# EAGLE design TCC modulo de automação Wifi Rev.2   (EAGLE 8.4.0)
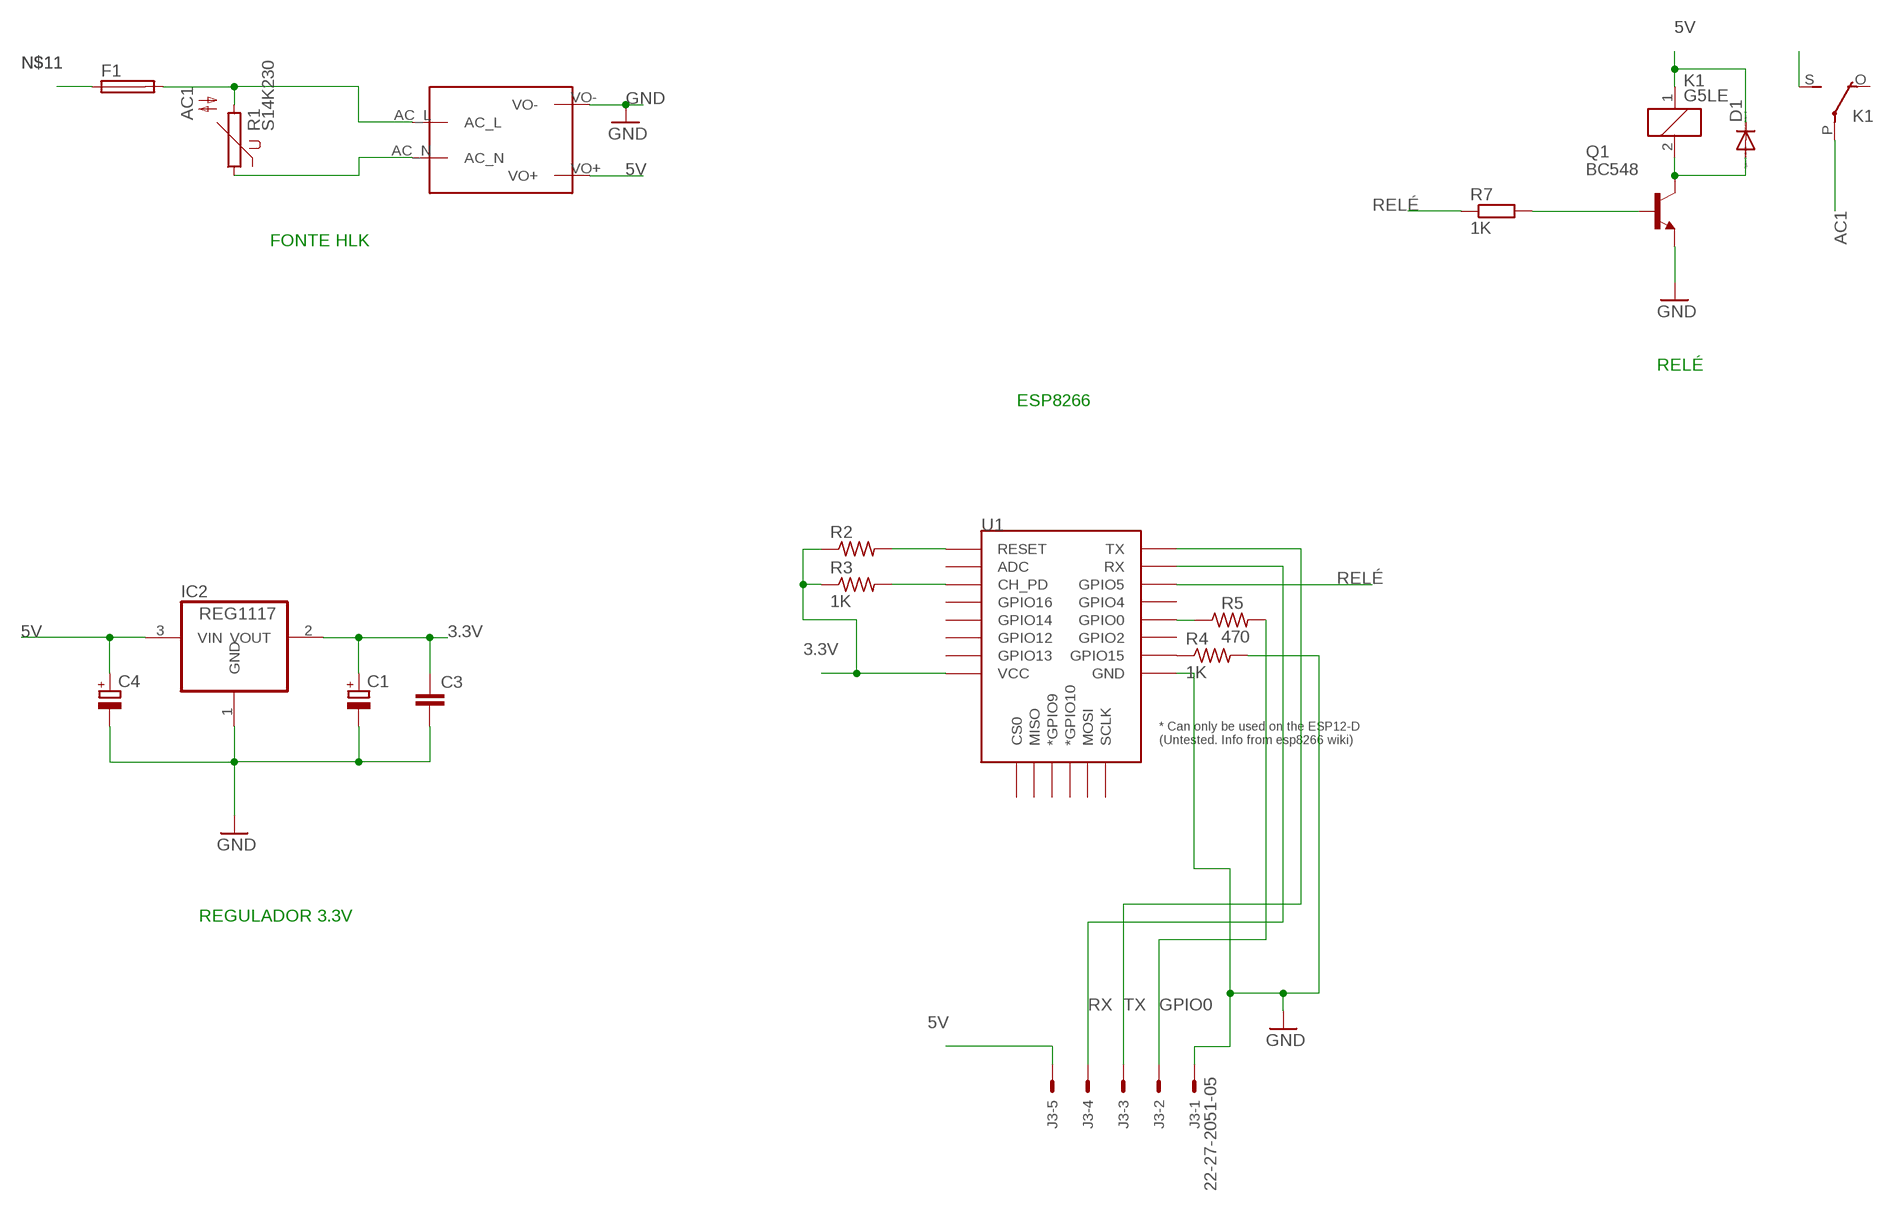
[diagram p0: schematic, sheet 1]

## Parts
C1  CPOL-EU153CLV-0505  [153CLV-0505]
C3  C-EUC0805  [C0805]
C4  CPOL-EUC/6032-28R  [C/6032-28R]
D1  DIODE-SOD106A-R  [SOD106A-R]
F1  SH22  [SH22]
IC2  REG1117  [SOT223]
J3  22-27-2051-05  [6410-05]
K1  G5LE  [G5LE]
Q1  BC548  [TO92-EBC]
R1  S14K230  [S14K230]
R2  R-US_M0805  [M0805]
R3  1K  R-US_M0805  [M0805]
R4  1K  R-US_M0805  [M0805]
R5  470  R-US_M0805  [M0805]
R7  1K  R-EU_M0805  [M0805]
U1  ESP12ESMD  [ESP12E-SMD]
U$2  MAINS_CONVERTERS  [HLK-PM01]

## Nets
3.3V: C1.+ C3.1 IC2.2(VOUT) R2.1 R3.1 U1.VCC
5V: C4.+ D1.C IC2.3(VIN) J3.5 K1.1 U$2.VO+
787: R1.1 U$2.AC_N
AC1: F1.2 K1.P(2:P) R1.2 U$2.AC_L
GND: C1.- C3.2 C4.- IC2.1(GND) J3.1 Q1.E R4.2 U1.GND U$2.VO-
GPIO0: J3.2 R5.2
N$1: R5.1 U1.GPIO0
N$2: R4.1 U1.GPIO15
N$3: Q1.B R7.2
N$4: D1.A K1.2 Q1.C
N$5: R2.2 U1.RESET
N$10: R3.2 U1.CH_PD
N$11: F1.1
N$12: K1.S(2:S)
RELÉ: R7.1 U1.GPIO5
RX: J3.4 U1.RXD0(RX)
TX: J3.3 U1.TXD0(TX)
Unconnected: K1.O(2:O) U1.ADC U1.CS0 U1.GPIO2 U1.GPIO4 U1.GPIO9(*GPIO9) U1.GPIO10(*GPIO10) U1.GPIO12 U1.GPIO13 U1.GPIO14 U1.GPIO16 U1.MISO U1.MOSI U1.SCLK

## Notes on the sheet
- FONTE HLK
- RELÉ
- ESP8266
- REGULADOR 3.3V

## Library data of the parts
C1 C4 = rcl:CPOL-EU: POLARIZED CAPACITOR, European symbol
C3 = rcl:C-EU: CAPACITOR, European symbol
D1 = diode:DIODE-: DIODE
F1 = fuse:SH22: FUSE HOLDER CS PFP30, Schukat; OC_FARNELL: unknown; OC_NEWARK: unknown
IC2 = burr-brown:REG1117: 800mA and 1A Low Dropout (LDO) Positive Regulator 1.8V, 2.5V, 2.85V, 3.3V, 5V, and Adj; MPN: REG1117; OC_FARNELL: 1097566; OC_NEWARK: 14P6981
J3 = con-molex:22-?-05: CONNECTOR wire to board 2.54 mm (.1 inch) pitch header; OC_FARNELL: unknown; OC_NEWARK: unknown
K1 = relay:G5LE: RELAY 1 x switch, 10 A/120 V AC, 8 A/30 V DC, Omron; OC_FARNELL: unknown; OC_NEWARK: unknown
Q1 = transistor-npn:BC548*: NPN Transistor
R1 = varistor:S14K230: VARISTOR
R2-R5 = resistor:R-US_: RESISTOR, American symbol
R7 = rcl:R-EU_: RESISTOR, European symbol
U1 = esp8266modules:ESP12E: ESP12E Module
U$2 = TCC roubado :MAINS_CONVERTERS

## Board
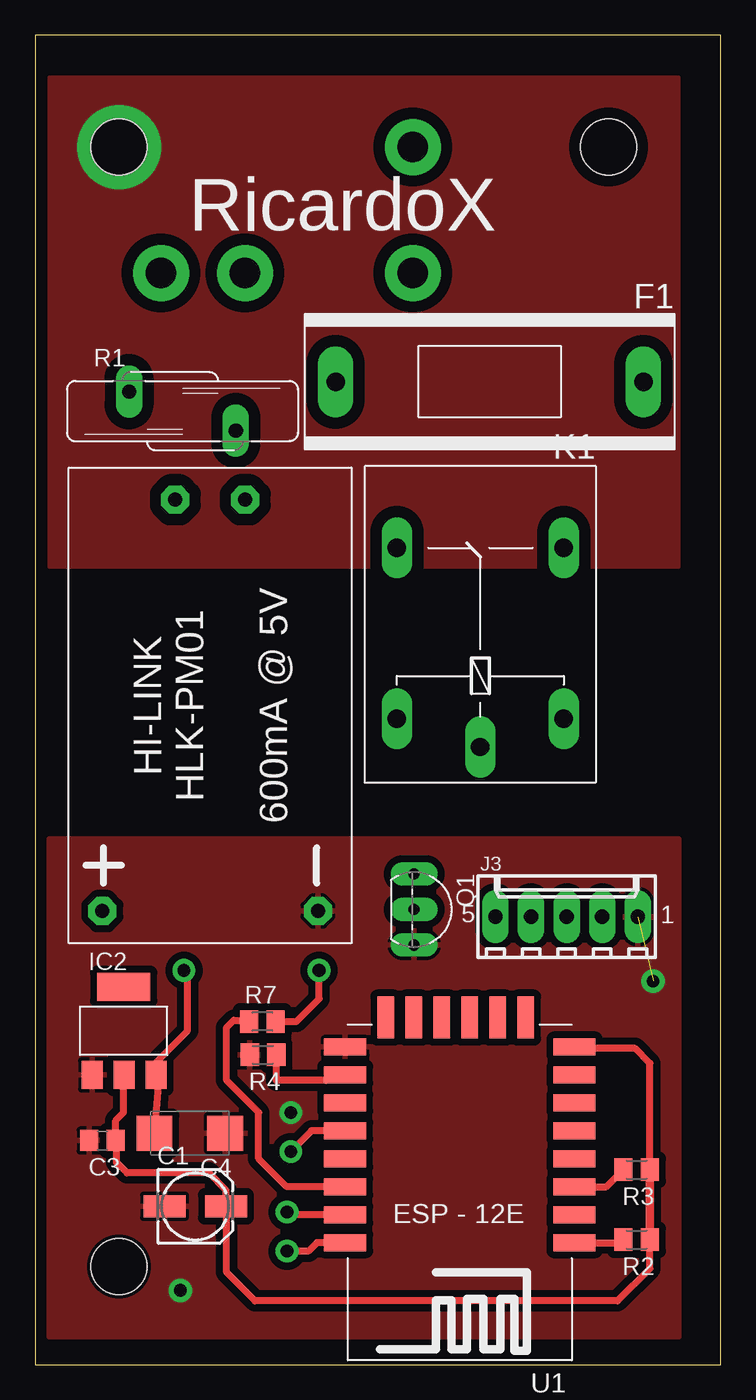
[diagram p1: board, top side]
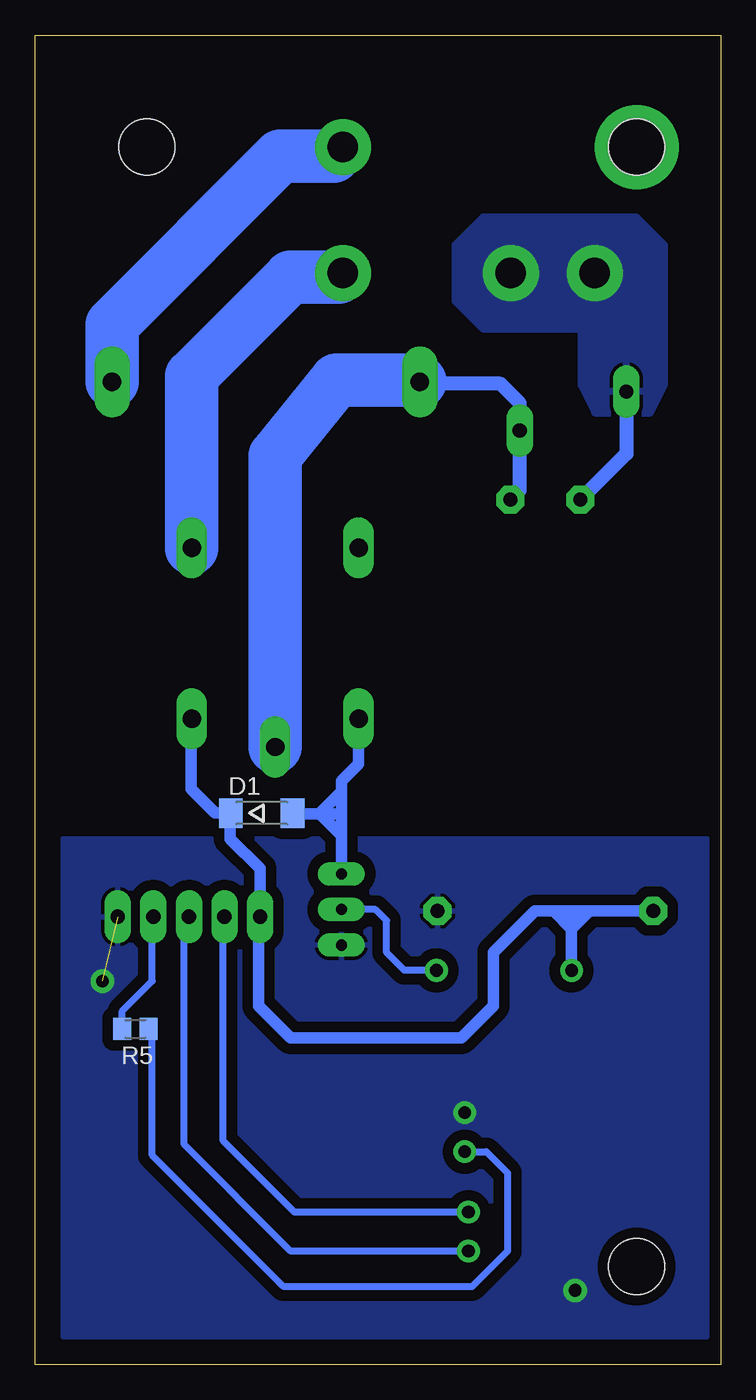
[diagram p2: board, bottom side, seen from below]

Size 49 x 95 mm. Coordinates in mm from the lower left corner, seen from the top.
Outline: 0,0 49,0 49,95 0,95 0,0
Copper layers (1*16): Top 0.035mm / dielectric 1.5mm / Bottom 0.035mm
Design rules "default *": minimum track width 16mil, minimum drill 24mil, track to track 20mil, track to pad 20mil, pad to pad 8mil, via to via 8mil, smd to smd 8mil, copper to edge 10mil, drill to drill 8mil, minimum pad ring 17mil, minimum via ring 14mil, stop-mask expansion 4mil, vias tented up to drill 0mil, thermal gap 10mil
Holes 4 mm at 6,7 41,87 6,87

### Footprints (pad centres in the part's own frame; a part is rotated, then mirrored left to right if it is on the bottom)
153CLV-0505 = smd 3 x 1.6: + 2.2,0; - -2.2,0
C0805 = smd 1.3 x 1.5: 1 -0.95,0; 2 0.95,0
C/6032-28R = smd 2.55 x 2.5: + 2.525,0; - -2.525,0
SOD106A-R = smd 1.7 x 2.1: A 2.2,0; C -2.2,0
SH22 = drill 1.321 pad 2.54 long: 1 -10.998,0; 2 10.998,0
SOT223 = smd 1.499 x 2.007: 1 -2.261,-3.15; 2 0.025,-3.15; 3 2.311,-3.15 | smd 3.81 x 2.007: 4 0,3.15
6410-05 = drill 1.016 long: 1 5.08,0; 2 2.54,0; 3 0,0; 4 -2.54,0; 5 -5.08,0
G5LE = drill 1.321 long: 1 -7.493,-5.969; 2 -7.493,5.969; O 4.699,5.969; P -9.525,0; S 4.699,-5.969
TO92-EBC = drill 0.813 long: B 0,-1.27; C -2.54,-1.27; E 2.54,-1.27
S14K230 = drill 1.016 long: 1 -1.397,-3.81; 2 1.397,3.81
M0805 = smd 1.3 x 1.6: 1 -0.95,0; 2 0.95,0
ESP12E-SMD = smd 3 x 1.2: ADC -8.3,3.8; CH_PD -8.3,1.8; GND 8.1,-8.2; GPIO0 8.1,-2.2; GPIO2 8.1,-4.2; GPIO4 8.1,-0.2; GPIO5 8.1,1.8; GPIO12 -8.3,-4.2; GPIO13 -8.3,-6.2; GPIO14 -8.3,-2.2; GPIO15 8.1,-6.2; GPIO16 -8.3,-0.2; RESET -8.3,5.8; RXD0 8.1,3.8; TXD0 8.1,5.8; VCC -8.3,-8.2 | smd 1.2 x 3: CS0 -4.8,-10.3; GPIO9 -0.8,-10.3; GPIO10 1.2,-10.3; MISO -2.8,-10.3; MOSI 3.2,-10.3; SCLK 5.2,-10.3
HLK-PM01 = drill 1 pad 2 octagon: AC_L -14.7,2.5; AC_N -14.7,-2.5; VO+ 14.7,-7.7; VO- 14.7,7.7

### Placement (x,y rotation side)
C1  11.46,11.3 0 top
C3  4.82,16.02 180 top
C4  11.06,16.52 180 top
D1  32.8,39.4 0 bottom
F1  32.5,70.23 180 top
IC2  6.33,23.84 0 top
J3  38,32 0 top
K1  31.83,53.65 90 top
Q1  28.36,32.51 270 top
R1  10.54,68.13 270 top
R2  43,8.92 180 top
R3  43,13.92 180 top
R4  16.3,22.13 180 top
R5  41.82,23.98 180 bottom
R7  16.25,24.51 0 top
U1  30.27,14.5 180 top
U$2  12.52,47.1 270 top

### Tracks (layer width: path | path; a pad name or v marks a point on that pad's centre or on a via)
3.3V
  Top 0.508: R3.1 43.95,21.53 42.91,22.57 37.43,22.57 U1.VCC | C1.+ 13.7,10.5 13.7,6.57 15.73,4.54 41.64,4.54 43.95,6.85 R2.1 43.95,8.98 | C1.+ 13.66,11.44 | IC2.2 6.33,19.65 6.33,18 5.77,17.44 C3.1 5.83,15.46 5.83,14.45 6.59,13.68 12.43,13.68 13.66,12.45 C1.+
  Top 0.61: 43.95,8.98 R3.1
5V  (via drill 0.9)
  Top 0.508: C4.+ 8.79,19.53 IC2.3 8.64,21.58 10.91,23.84 10.91,27.91 v10.65,28.16
  Bottom 0.813: 9.38,32.4 10.91,32.4 | 9.38,32.4 U$2.VO+ | 11.92,32.4 10.91,32.4 | 11.92,32.4 13.27,32.4 16.24,29.43 16.24,25.62 18.53,23.34 30.72,23.34 33,25.62 33,31.92 J3.5 32.92,35.44 35.04,37.56 35.04,39.36 D1.C 36.11,39.4 37.83,41.12 37.83,46.13 K1.1 | v10.65,28.16 10.65,32.15 10.91,32.4 | 11.92,32.4 10.65,31.13 9.38,32.4
787  (via drill 2.2 pad 4)
  Bottom 1.016: R1.1 6.73,65.09 U$2.AC_N
  other vias: 9,78 15,78
  pour Bottom: 9,68 5,68 4,70 4,80 6,82 17,82 19,80 19,76 17,74 10,74 10,70
AC1
  Bottom 1.016: U$2.AC_L 14.35,62.47 R1.2 14.35,68.69 15.73,70.07 21.34,70.07 F1.2
  Bottom 3.81: K1.P 31.83,64.93 27.43,70.33 21.59,70.33 F1.2
GND  (via drill 0.9, 0.9 pad 1.68)  (1 unrouted)
  other vias: 18.27,18 10.4,5.3 44.18,27.4
  pour Bottom (isolate 0.762): 1,37.56 47,37.56 47,2 1,2
  pour Top: 1,37.56 1,2 46,2 46,37.56
GPIO0
  Bottom 0.508: R5.2 42.77,25.26 40.62,27.4 40.62,31.92 J3.2
MASS  (via drill 4 pad 6)
  other vias: 6,87
  pour Top (isolate 0.813): 1,92 46,92 46,57 1,57
N$1  (via drill 0.9)
  Top 0.508: U1.GPIO0 19.76,16.7 v18.27,15.21
  Bottom 0.508: R5.1 40.62,23.74 40.62,14.95 31.23,5.56 17.76,5.56 15.22,8.1 15.22,13.68 16.75,15.21 v18.27,15.21
N$2
  Top 0.508: R4.1 17.26,20.29 20.81,20.29 U1.GPIO15
N$3  (via drill 0.9)
  Top 0.508: R7.2 18.68,24.51 20.3,26.13 v20.3,28.16
  Bottom 0.508: v20.3,28.16 22.59,28.16 23.86,29.43 23.86,31.72 24.65,32.51 Q1.B
N$4
  Bottom 0.813: 27.09,37.81 Q1.C | 27.09,37.81 27.09,39.34 | 27.09,39.34 27.09,40.86 | 27.09,40.86 27.09,41.69 25.89,42.89 25.89,46.13 K1.2 | 27.09,39.34 28.69,39.34 | 28.69,39.34 30.54,39.34 D1.A | 27.09,40.86 27.16,40.86 28.69,39.34 | 28.69,39.34 28.62,39.34 27.09,37.81
N$5
  Top 0.508: U1.RESET 41.83,8.7 R2.2
N$10
  Top 0.508: U1.CH_PD 40.83,12.7 R3.2
N$11  (via drill 2.2 pad 4)
  Bottom 3.81: F1.1 43.49,74.31 31.48,86.33 27.67,86.33 v27,87
N$12  (via drill 2.2 pad 4)
  Bottom 3.81: K1.S 37.8,70.61 30.72,77.69 27.31,77.69 v27,78
RELÉ
  Top 0.508: U1.GPIO5 17.99,12.7 15.99,14.7 15.99,18 13.7,20.29 13.7,24.1 14.21,24.61 15.21,24.61 R7.1
RX  (via drill 0.9)
  Top 0.508: 22.34,10.64 21.32,10.64 U1.RXD0 18.21,10.7 v18.02,10.89
  Bottom 0.508: v18.02,10.89 30.46,10.89 35.54,15.97 35.54,31.92 J3.4
TX  (via drill 0.9)
  Top 0.508: U1.TXD0 20.15,8.7 19.54,8.1 v18.02,8.1
  Bottom 0.508: v18.02,8.1 30.72,8.1 38.34,15.72 38.34,31.66 J3.3

### Text on the board
tNames: RicardoX